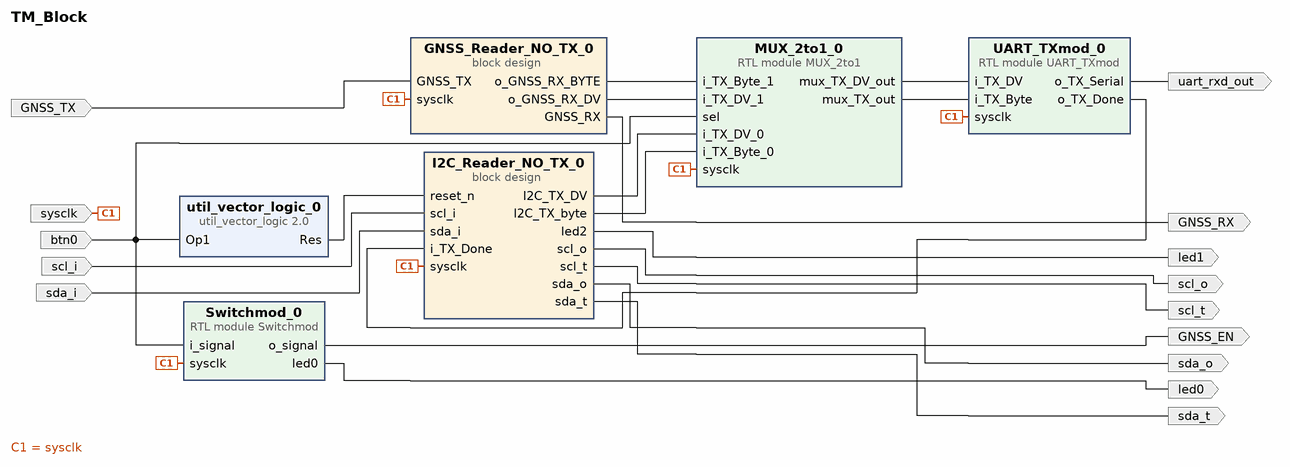
[diagram p0: block diagram of the top level]
# Vivado block design TM_Block, xc7a35tcpg236-1, Vivado 2024.2
create_bd_design TM_Block

create_bd_port -dir I sda_i
create_bd_port -dir I scl_i
create_bd_port -dir I sysclk
create_bd_port -dir I GNSS_TX
create_bd_port -dir I btn0
create_bd_port -dir O GNSS_RX
create_bd_port -dir O GNSS_EN
create_bd_port -dir O led0
create_bd_port -dir O uart_rxd_out
create_bd_port -dir O sda_o
create_bd_port -dir O sda_t
create_bd_port -dir O scl_o
create_bd_port -dir O scl_t
create_bd_port -dir O led1

create_bd_cell -type module -reference MUX_2to1 MUX_2to1_0
create_bd_cell -type module -reference UART_TXmod UART_TXmod_0
create_bd_cell -type module -reference Switchmod Switchmod_0
create_bd_cell -type ip -vlnv xilinx.com:ip:util_vector_logic:2.0 util_vector_logic_0
set_property -dict {CONFIG.C_OPERATION not CONFIG.C_SIZE 1} [get_bd_cells util_vector_logic_0]
create_bd_cell -type container -reference GNSS_Reader_NO_TX GNSS_Reader_NO_TX_0
set_property -dict [list \
  CONFIG.ACTIVE_SIM_BD GNSS_Reader_NO_TX.bd \
  CONFIG.ACTIVE_SYNTH_BD GNSS_Reader_NO_TX.bd \
  CONFIG.ENABLE_DFX 0 \
  CONFIG.LIST_SIM_BD GNSS_Reader_NO_TX.bd \
  CONFIG.LIST_SYNTH_BD GNSS_Reader_NO_TX.bd \
  CONFIG.LOCK_PROPAGATE 0 \
] [get_bd_cells GNSS_Reader_NO_TX_0]
create_bd_cell -type container -reference I2C_Reader_NO_TX I2C_Reader_NO_TX_0
set_property -dict [list \
  CONFIG.ACTIVE_SIM_BD I2C_Reader_NO_TX.bd \
  CONFIG.ACTIVE_SYNTH_BD I2C_Reader_NO_TX.bd \
  CONFIG.ENABLE_DFX 0 \
  CONFIG.LIST_SIM_BD I2C_Reader_NO_TX.bd \
  CONFIG.LIST_SYNTH_BD I2C_Reader_NO_TX.bd \
  CONFIG.LOCK_PROPAGATE 0 \
] [get_bd_cells I2C_Reader_NO_TX_0]

# ---- connections ----

connect_bd_net [get_bd_pins GNSS_Reader_NO_TX_0/GNSS_RX] [get_bd_ports GNSS_RX]
connect_bd_net [get_bd_pins GNSS_Reader_NO_TX_0/o_GNSS_RX_BYTE] [get_bd_pins MUX_2to1_0/i_TX_Byte_1]
connect_bd_net [get_bd_pins GNSS_Reader_NO_TX_0/o_GNSS_RX_DV] [get_bd_pins MUX_2to1_0/i_TX_DV_1]
connect_bd_net [get_bd_ports GNSS_TX] [get_bd_pins GNSS_Reader_NO_TX_0/GNSS_TX]
connect_bd_net [get_bd_pins I2C_Reader_NO_TX_0/I2C_TX_DV] [get_bd_pins MUX_2to1_0/i_TX_DV_0]
connect_bd_net [get_bd_pins I2C_Reader_NO_TX_0/I2C_TX_byte] [get_bd_pins MUX_2to1_0/i_TX_Byte_0]
connect_bd_net [get_bd_pins I2C_Reader_NO_TX_0/led2] [get_bd_ports led1]
connect_bd_net [get_bd_pins I2C_Reader_NO_TX_0/scl_o] [get_bd_ports scl_o]
connect_bd_net [get_bd_pins I2C_Reader_NO_TX_0/scl_t] [get_bd_ports scl_t]
connect_bd_net [get_bd_pins I2C_Reader_NO_TX_0/sda_o] [get_bd_ports sda_o]
connect_bd_net [get_bd_pins I2C_Reader_NO_TX_0/sda_t] [get_bd_ports sda_t]
connect_bd_net [get_bd_pins MUX_2to1_0/mux_TX_DV_out] [get_bd_pins UART_TXmod_0/i_TX_DV]
connect_bd_net [get_bd_pins MUX_2to1_0/mux_TX_out] [get_bd_pins UART_TXmod_0/i_TX_Byte]
connect_bd_net [get_bd_pins Switchmod_0/led0] [get_bd_ports led0]
connect_bd_net [get_bd_pins Switchmod_0/o_signal] [get_bd_ports GNSS_EN]
connect_bd_net [get_bd_pins UART_TXmod_0/o_TX_Serial] [get_bd_ports uart_rxd_out]
connect_bd_net -net btn0_1 [get_bd_ports btn0] [get_bd_pins MUX_2to1_0/sel] [get_bd_pins Switchmod_0/i_signal] [get_bd_pins util_vector_logic_0/Op1]
connect_bd_net -net i_TX_Done_1 [get_bd_pins UART_TXmod_0/o_TX_Done] [get_bd_pins I2C_Reader_NO_TX_0/i_TX_Done]
connect_bd_net -net reset_n_1 [get_bd_pins util_vector_logic_0/Res] [get_bd_pins I2C_Reader_NO_TX_0/reset_n]
connect_bd_net [get_bd_ports scl_i] [get_bd_pins I2C_Reader_NO_TX_0/scl_i]
connect_bd_net [get_bd_ports sda_i] [get_bd_pins I2C_Reader_NO_TX_0/sda_i]
connect_bd_net [get_bd_ports sysclk] \
  [get_bd_pins MUX_2to1_0/sysclk] [get_bd_pins UART_TXmod_0/sysclk] [get_bd_pins Switchmod_0/sysclk] \
  [get_bd_pins GNSS_Reader_NO_TX_0/sysclk] [get_bd_pins I2C_Reader_NO_TX_0/sysclk]

validate_bd_design
save_bd_design
